# Altium schematic sheet Connectors.SchDoc
size A; DocumentNumber: 6; SheetNumber: 6; SheetTotal: 6
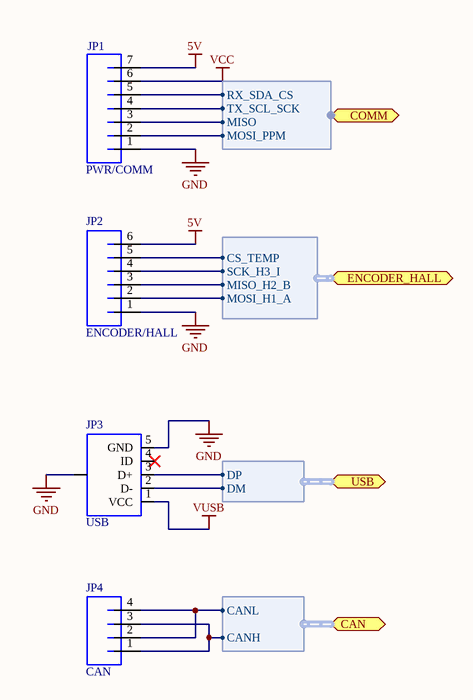
[diagram p0: Connectors.SchDoc]

## Parts
JP1  PWR/COMM  [JST-PH-7-PTH-VERT]
JP2  ENCODER/HALL  [JST-PH-6-PTH-VERT]
JP3  USB  [USB-MICROB]
JP4  CAN  [JST-PH-4-PTH-VERT]

## Ports
CAN (harness CAN Output), COMM (harness Comm), ENCODER_HALL (harness Encoder/Hall), USB (harness USB)

## Harnesses
CAN Output: CANL, CANH
USB: DP, DM
Encoder/Hall: CS_TEMP, SCK_H3_I, MISO_H2_B, MOSI_H1_A
Comm: RX_SDA_CS, TX_SCL_SCK, MISO, MOSI_PPM

## Nets
5V: JP1.7 JP2.6
GND: JP1.1 JP2.1 JP3.5(GND) JP3.6(SHIELD)
VCC: JP1.6
VUSB: JP3.1(VCC)
NetJP1_2: JP1.2 ; port COMM.MOSI_PPM
NetJP1_3: JP1.3 ; port COMM.MISO
NetJP1_4: JP1.4 ; port COMM.TX_SCL_SCK
NetJP1_5: JP1.5 ; port COMM.RX_SDA_CS
NetJP2_2: JP2.2 ; port ENCODER_HALL.MOSI_H1_A
NetJP2_3: JP2.3 ; port ENCODER_HALL.MISO_H2_B
NetJP2_4: JP2.4 ; port ENCODER_HALL.SCK_H3_I
NetJP2_5: JP2.5 ; port ENCODER_HALL.CS_TEMP
NetJP3_2: JP3.2(D-) ; port USB.DM
NetJP3_3: JP3.3(D+) ; port USB.DP
NetJP4_1: JP4.1 JP4.3 ; port CAN.CANH
NetJP4_2: JP4.2 JP4.4 ; port CAN.CANL

Not connected (* = marked no-connect by the designer): JP3 4(ID)*

## Library data of the parts
JP1 = JST_PH_7_VERT: PartNumber: B7B-PH-K-S(LF)(SN); Manufacturer: JST Sales America Inc.; Mounting Technology: Through Hole; PackageReference: JST-PH
JP2 = JST_PH_6_VERT: PartNumber: B6B-PH-K-S(LF)(SN); Manufacturer: JST Sales America Inc.; PackageReference: JST-PH; Mounting Technology: Through Hole
JP3 = USB_MICROB_SMT: pin to pad: 1>VBUS 2>D- 3>D+ 4>ID 5>GND 6>MT1+P$1+P$2+MT2; PartNumber: 10118192-0001LF; Manufacturer: Amphenol FCI; Mounting Technology: Surface Mount; PackageReference: USB - Micro B
JP4 = JST_PH_4_VERT: PartNumber: B4B-PH-K-S(LF)(SN); Manufacturer: JST Sales America Inc.; PackageReference: JST-PH; Mounting Technology: Through Hole